# EAGLE design board (EAGLE 6.4)
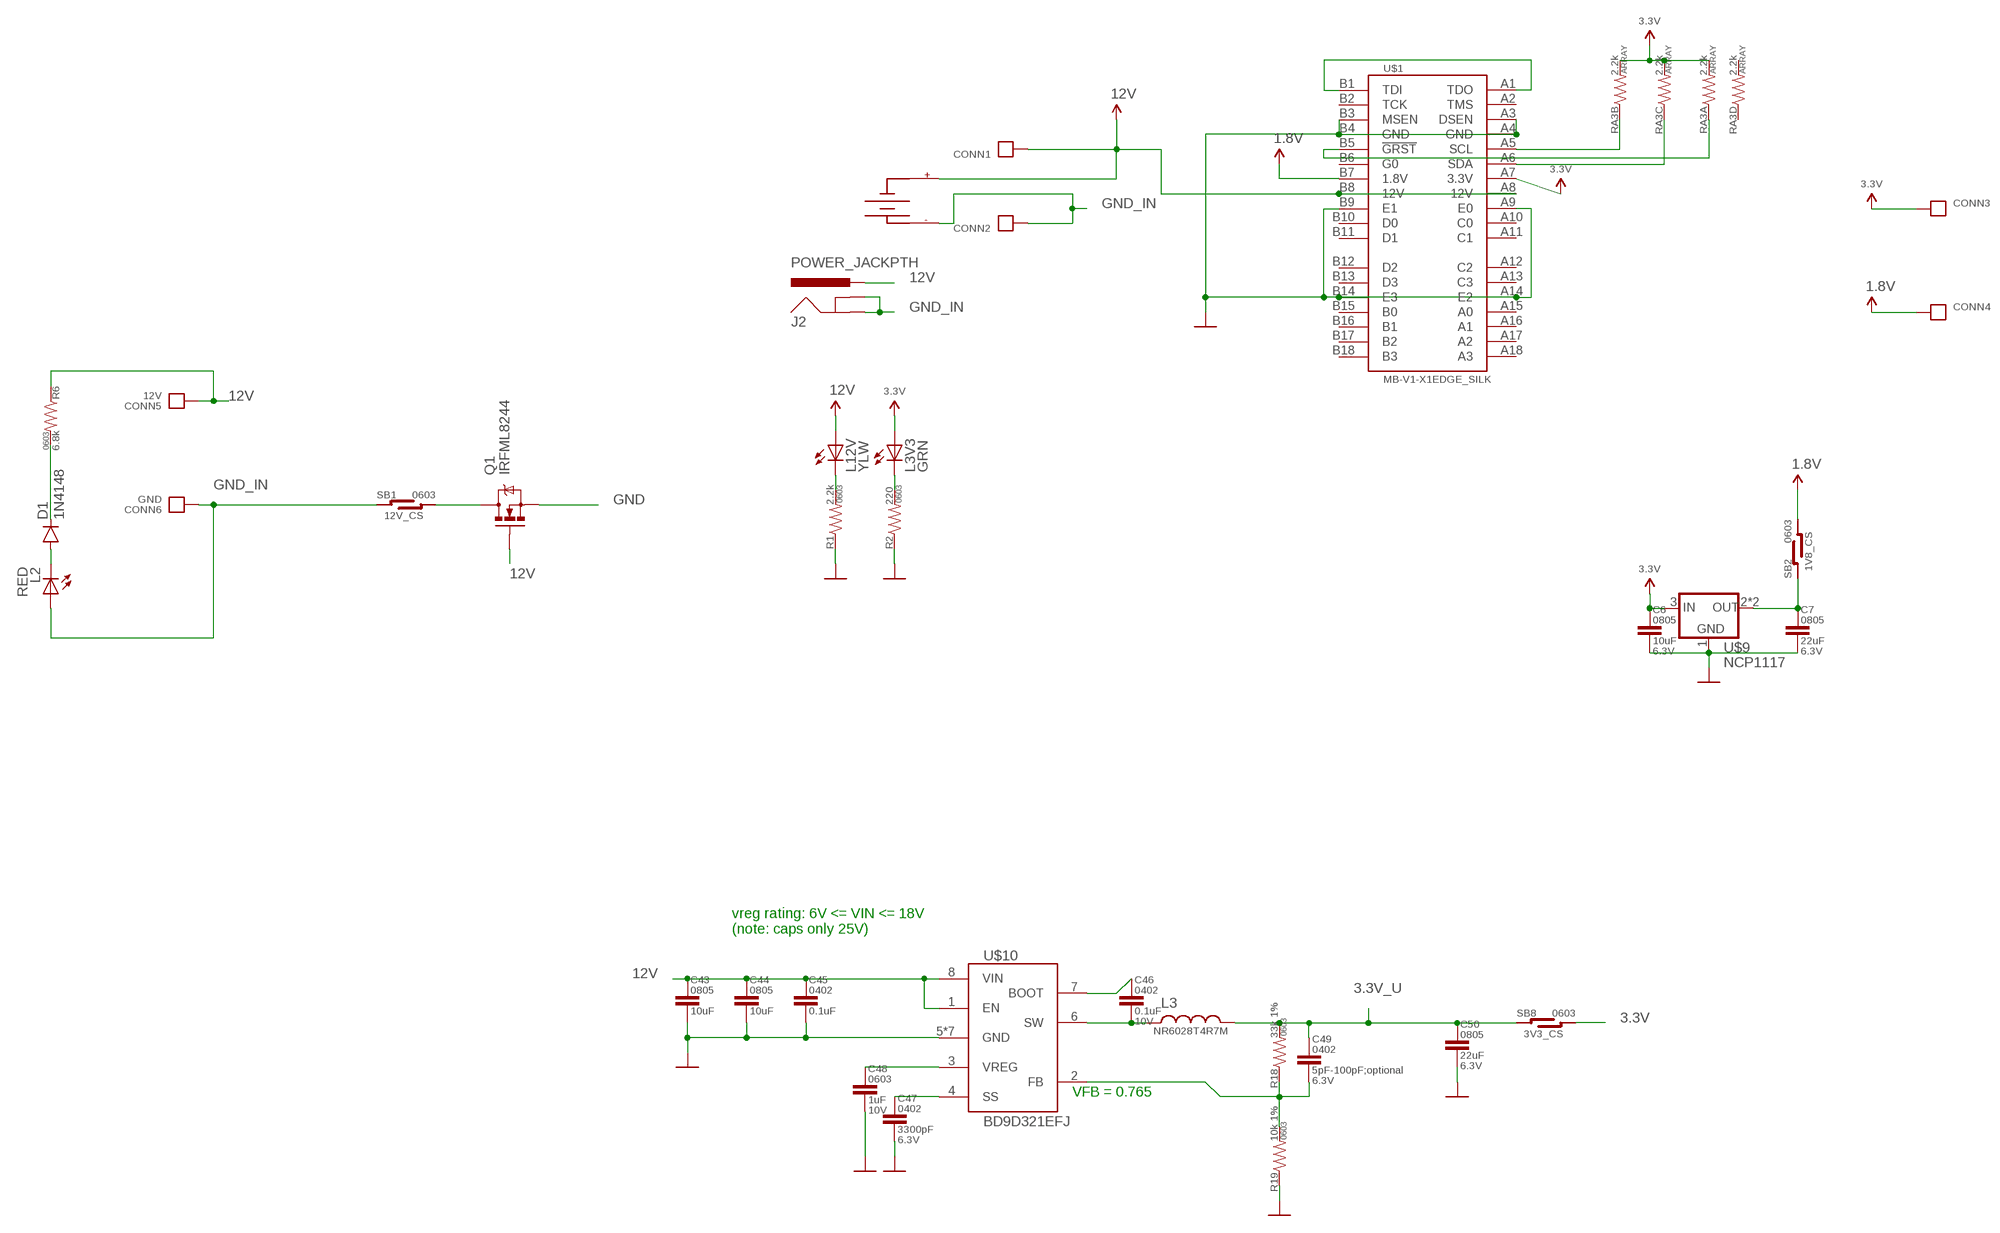
[diagram p0: schematic, sheet 1]

## Parts
C6  10uF  CAP0805  [0805-CAP]
C7  22uF  CAP0805  [0805-CAP]
C43  10uF  CAP0805  [0805-CAP]
C44  10uF  CAP0805  [0805-CAP]
C45  0.1uF  CAP0402-CAP  [0402-CAP]
C46  0.1uF  CAP0402-CAP  [0402-CAP]
C47  3300pF  CAP0402-CAP  [0402-CAP]
C48  1uF  CAP0603  [0603-CAP]
C49  5pF-100pF;optional  CAP0402-CAP  [0402-CAP]
C50  22uF  CAP0805  [0805-CAP]
CONN1  CONNECTOR18AWG  [HOLE_18AWG]
CONN2  CONNECTOR18AWG  [HOLE_18AWG]
CONN3  CONNECTOR18AWG  [HOLE_18AWG]
CONN4  CONNECTOR18AWG  [HOLE_18AWG]
CONN5  12V  CONNECTORSCREW_2.5MM  [SCREW_2.5MM]
CONN6  GND  CONNECTORSCREW_2.5MM  [SCREW_2.5MM]
D1  1N4148  DIODESOD  [SOD-323]
J2  POWER_JACKPTH  [POWER_JACK_PTH]
L2  RED  LED0603  [0603_LED]
L3  NR6028T4R7M  INDUCTORNR60XX  [NR60XX]
L3V3  GRN  LED0603  [0603_LED]
L12V  YLW  LED0603  [0603_LED]
Q1  IRFML8244  MOSFET-NCHANNELBSS138  [SOT23]
R1  2.2k  RESISTOR0603  [0603-RES]
R2  220  RESISTOR0603  [0603-RES]
R6  6.8k  RESISTOR0603  [0603-RES]
R18  33k 1%  RESISTOR0603  [0603-RES]
R19  10k 1%  RESISTOR0603  [0603-RES]
RA3  2.2k  RESISTOR_ARRAY0603_X4  [0603-ARV]
SB1  12V_CS  SOLDER-BRIDGE0603  [SB-0603]
SB2  1V8_CS  SOLDER-BRIDGE0603  [SB-0603]
SB8  3V3_CS  SOLDER-BRIDGE0603  [SB-0603]
U$1  MB-V1-X1EDGE_SILK  [MB-V1-X1-EDGE]
U$4  SUPPLYPCIE-6-RA  [MOLEX_MINIFITJR_6_RA]
U$9  NCP1117  VREGSOT223  [SOT223]
U$10  BD9D321EFJ  [HTSOP8]

## Nets
1.8V: CONN4.P$1(P) SB2.R1 SB2.R2 U$1.B7(1.8V)
3.3V: C6.1 CONN3.P$1(P) L3V3.A RA3.6 RA3.7 RA3.8 SB8.R1 SB8.R2 U$1.A7(3.3V) U$9.3(IN)
3.3V_FB: C49.2 R18.1 R19.2 U$10.2(FB)
3.3V_U: C49.1 C50.1 L3.P$2 R18.2 SB8.L1 SB8.L2
12V: C43.1 C44.1 C45.1 CONN1.P$1(P) CONN5.P J2.PWR L12V.A Q1.1(G) R6.1 U$1.A8(12V) U$1.B8(12V) U$4.1(VSUPPLY) U$4.3(VSUPPLY) U$10.1(EN) U$10.8(VIN)
GND: C6.2 C7.2 C43.2 C44.2 C45.2 C47.2 C48.2 C50.2 Q1.2(S) R1.1 R2.1 R19.1 U$1.A3(DSEN) U$1.A4(GND) U$1.A9(E0) U$1.A14(E2) U$1.B3(MSEN) U$1.B4(GND) U$1.B9(E1) U$1.B14(E3) U$9.1(GND) U$10.5(GND) U$10.P$1(GND) U$10.P$2(GND) U$10.P$3(GND) U$10.P$4(GND) U$10.P$5(GND) U$10.PAD(GND)
GND_IN: CONN2.P$1(P) CONN6.P J2.GND J2.GNDBREAK L2.A SB1.L1 SB1.L2 U$4.4(GND) U$4.6(GND)
N$1: L12V.C R1.2
N$2: C7.1 SB2.L1 SB2.L2 U$9.2(OUT) U$9.4(OUT)
N$6: L3V3.C R2.2
N$8: RA3.3 U$1.A6(SDA)
N$10: Q1.3(D) SB1.R1 SB1.R2
N$11: D1.C R6.2
N$12: RA3.2 U$1.A5(SCL)
N$13: RA3.1 U$1.B5(!GRST)
N$14: D1.A L2.C
N$70: C46.2 L3.P$1 U$10.6(SW)
N$71: C46.1 U$10.7(BOOT)
N$72: C48.1 U$10.3(VREG)
N$76: C47.1 U$10.4(SS)
TDI: U$1.A1(TDO) U$1.B1(TDI)
Unconnected: RA3.4 RA3.5 U$1.A2(TMS) U$1.A10(C0) U$1.A11(C1) U$1.A12(C2) U$1.A13(C3) U$1.A15(A0) U$1.A16(A1) U$1.A17(A2) U$1.A18(A3) U$1.B2(TCK) U$1.B6(G0) U$1.B10(D0) U$1.B11(D1) U$1.B12(D2) U$1.B13(D3) U$1.B15(B0) U$1.B16(B1) U$1.B17(B2) U$1.B18(B3)

## Notes on the sheet
- vreg rating: 6V <= VIN <= 18V
  (note: caps only 25V)
- VFB = 0.765

## Library data of the parts
C6 C7 C50 = kmod-passives:CAP: Capacitor Standard 0603 ceramic capacitor, and 0.1" leaded capacitor.; PACKAGE: 0805; VOLTAGE: 6.3V
C43 C44 = kmod-passives:CAP: Capacitor Standard 0603 ceramic capacitor, and 0.1" leaded capacitor.; PACKAGE: 0805; VOLTAGE: 25V
C45 = kmod-passives:CAP: Capacitor Standard 0603 ceramic capacitor, and 0.1" leaded capacitor.; PACKAGE: 0402; VOLTAGE: 25V
C46 = kmod-passives:CAP: Capacitor Standard 0603 ceramic capacitor, and 0.1" leaded capacitor.; PACKAGE: 0402; VOLTAGE: 10V
C47 C49 = kmod-passives:CAP: Capacitor Standard 0603 ceramic capacitor, and 0.1" leaded capacitor.; PACKAGE: 0402; VOLTAGE: 6.3V
C48 = kmod-passives:CAP: Capacitor Standard 0603 ceramic capacitor, and 0.1" leaded capacitor.; PACKAGE: 0603; VOLTAGE: 10V
CONN1-CONN6 = kmod-nonparts:CONNECTOR: Collection of holes/pads for testing/connecting
D1 = SparkFun-DiscreteSemi:DIODE: Diode These are standard reverse protection diodes and small signal diodes. SMA package can handle up to about 1A. SOD-323 can handle about 200mA. What the SOD-323 package when ordering, there are some mfgs out there that are 5-pin packages.; PROD_ID: DIO-09646
J2 = SparkFun-Connectors:POWER_JACK: Power Jack This is the standard 5.5mm barrel jack for power. The PTH is the most common, proven, reliable, footprint. The Slot footprint only works if the mill layer is transmitted to the PCB fab house so be warned. Mating wall wart : TOL-00298 (and others); PROD_ID: PRT-00119
L2 L3V3 L12V = kmod-passives:LED
L3 = kmod-passives:INDUCTOR
Q1 = SparkFun-DiscreteSemi:MOSFET-NCHANNEL: Common NMOSFET Parts MFG P/N Store ID Prod ID FDD8780 TRANS-09984 SI7820DN TRANS-11055 FDS6630A IC-08089 2N7002PW TRANS-11151 FQP30N06L COM-10213 TRANS-10060 BSS123LT1G TRANS-08345 BSS138 TRANS-00830 BS170 2N7000; PROD_ID: TRANS-00830
R1 R2 R6 R18 R19 = kmod-passives:RESISTOR: Resistor Basic schematic elements and footprints for 0603, 1206, and PTH resistors.; PACKAGE: 0603
RA3 = kmod-passives:RESISTOR_ARRAY; PACKAGE: ARRAY
SB1 SB2 SB8 = kmod-nonparts:SOLDER-BRIDGE; PACKAGE: 0603
U$1 = kmod-connectors:MB-V1-X1
U$4 = kmod-connectors:SUPPLY
U$9 = kmod-ics:VREG
U$10 = kmod-testing:BD9D321

## Board
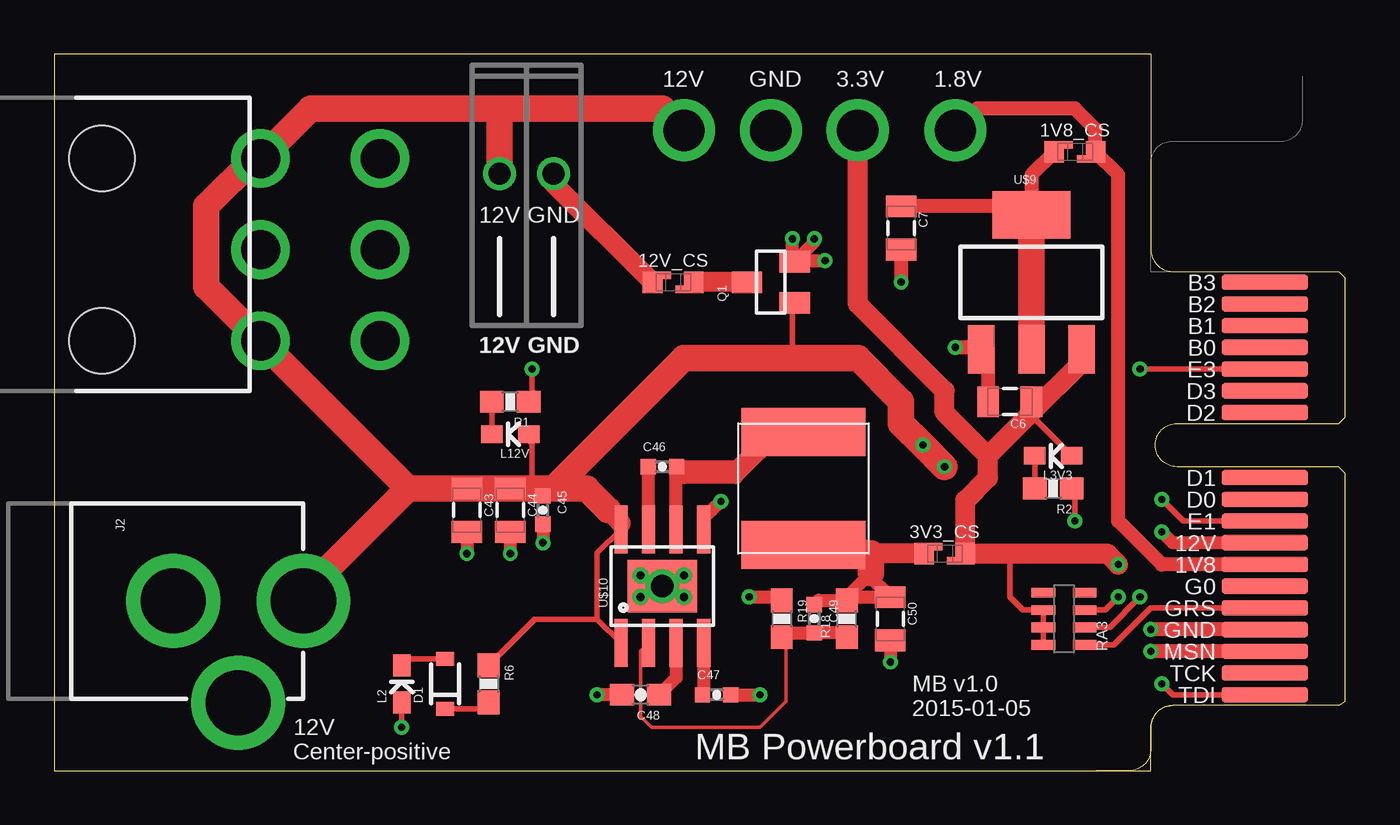
[diagram p1: board, top side]
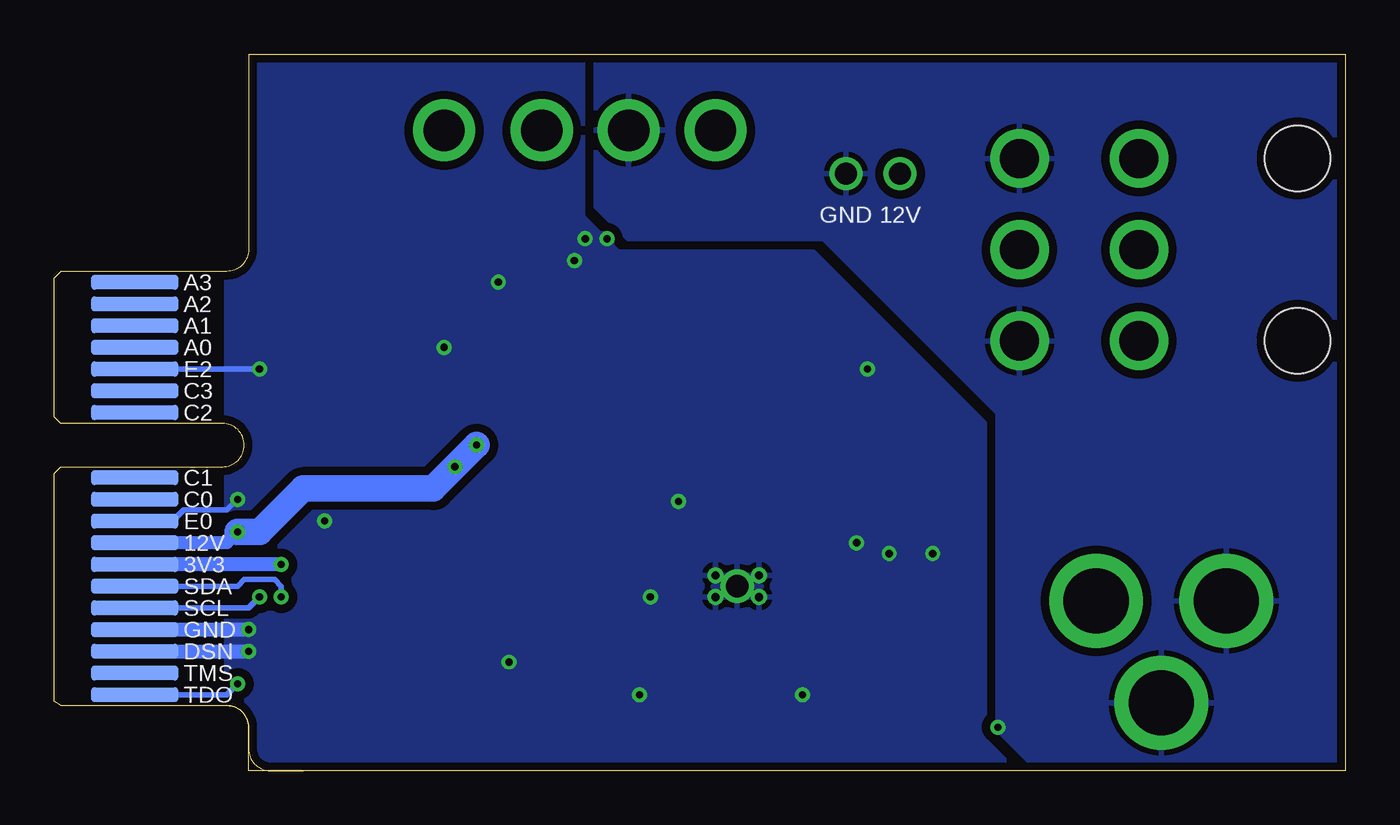
[diagram p2: board, bottom side, seen from below]

Size 59.45 x 33 mm. Coordinates in mm from the lower left corner, seen from the top.
Outline: 51.5,3 arc90 50.5,2 50.5,0 0,0 0,33 50.5,33 50.5,24 arc90 51.5,23
Copper layers (1*16): Top 0.0356mm / dielectric 1.5011mm / Bottom 0.0356mm
Design rules "OSHPark_mine": minimum track width 6mil, minimum drill 13mil, track to track 6mil, track to pad 6mil, pad to pad 6mil, via to via 6mil, smd to smd 6mil, copper to edge 15mil, drill to drill 6mil, minimum pad ring 7mil, minimum via ring 7mil, stop-mask expansion 2mil, vias tented up to drill 13mil, thermal gap 10mil

### Footprints (pad centres in the part's own frame; a part is rotated, then mirrored left to right if it is on the bottom)
0805-CAP = smd 1 x 1.4: 1 -1,0; 2 1,0
0402-CAP = smd 0.7 x 0.7: 1 -0.65,0; 2 0.65,0
0603-CAP = smd 1.1 x 1: 1 -0.85,0; 2 0.85,0
HOLE_18AWG = drill 1.905: P$1 0,0
SCREW_2.5MM = drill 1.016: P 0,0
SOD-323 = smd 0.63 x 0.83: A 1.15,0; C -1.15,0
POWER_JACK_PTH = drill 2.997 pad 4.318: GND 0,7.7; GNDBREAK 4.7,10.7; PWR 0,13.7
0603_LED = smd 0.8 x 1.003: A 0,-0.852; C 0,0.852
NR60XX = smd 2.2 x 5.7: P$1 2.6,0; P$2 -2.6,0
SOT23 = smd 1 x 1.4: 1 -0.95,-1.1; 2 0.95,-1.1; 3 0,1.1
0603-RES = smd 1.1 x 1: 1 -0.85,0; 2 0.85,0
0603-ARV = smd 0.45 x 1.1: 1 -1.2,-0.95; 2 -0.4,-0.95; 3 0.4,-0.95; 4 1.2,-0.95; 5 1.2,0.95; 6 0.4,0.95; 7 -0.4,0.95; 8 -1.2,0.95
SB-0603 = smd 0.9 x 1: L1 -0.95,0; R1 0.95,0 | smd 0.4 x 0.35: L2 -0.3,0.325; R2 0.3,-0.325
MB-V1-X1-EDGE = smd 0.7 x 4 bottom: A1 -11.5,-0.75; A2 -10.5,-0.75; A3 -9.5,-0.75; A4 -8.5,-0.75; A5 -7.5,-0.75; A6 -6.5,-0.75; A7 -5.5,-0.75; A8 -4.5,-0.75; A9 -3.5,-0.75; A10 -2.5,-0.75; A11 -1.5,-0.75; A12 1.5,-0.75; A13 2.5,-0.75; A14 3.5,-0.75; A15 4.5,-0.75; A16 5.5,-0.75; A17 6.5,-0.75; A18 7.5,-0.75 | smd 0.7 x 4: B1 -11.5,-0.75; B2 -10.5,-0.75; B3 -9.5,-0.75; B4 -8.5,-0.75; B5 -7.5,-0.75; B6 -6.5,-0.75; B7 -5.5,-0.75; B8 -4.5,-0.75; B9 -3.5,-0.75; B10 -2.5,-0.75; B11 -1.5,-0.75; B12 1.5,-0.75; B13 2.5,-0.75; B14 3.5,-0.75; B15 4.5,-0.75; B16 5.5,-0.75; B17 6.5,-0.75; B18 7.5,-0.75
MOLEX_MINIFITJR_6_RA = drill 1.8: 1 4.2,0; 2 0,0; 3 -4.2,0; 4 4.2,5.5; 5 0,5.5; 6 -4.2,5.5 | hole 3: -4.2,-7.3; 4.2,-7.3
SOT223 = smd 1.219 x 2.235: 1 -2.311,-3.099; 2 0,-3.099; 3 2.311,-3.099 | smd 3.6 x 2.2: 4 0,3.099
HTSOP8 = smd 0.61 x 2.21: 1 -1.905,-2.616; 2 -0.635,-2.616; 3 0.635,-2.616; 4 1.905,-2.616; 5 1.905,2.616; 6 0.635,2.616; 7 -0.635,2.616; 8 -1.905,2.616 | drill 1.016: P$1 0,0 | drill 0.381: P$2 -1,0.5; P$3 -1,-0.5; P$4 1,-0.5; P$5 1,0.5 | smd 3.2 x 2.4: PAD 0,0

### Placement (x,y rotation side)
C6  44,17 180 top
C7  39,25 270 top
C43  19,12 270 top
C44  21,12 270 top
C45  22.5,12 270 top
C46  28,14 0 top
C47  30.5,3.5 0 top
C48  27,3.5 180 top
C49  35,7 270 top
C50  38.5,7 270 top
CONN1  29,29.5 90 top
CONN2  33,29.5 90 top
CONN3  37,29.5 0 top
CONN4  41.5,29.5 0 top
CONN5  20.5,27.5 180 top
CONN6  23,27.5 180 top
D1  18,4 90 top
J2  -2.23,7.82 270 top
L2  16,4 0 top
L3  34.5,13 90 top
L3V3  46,14.5 90 top
L12V  21,15.5 90 top
Q1  33,22.5 90 top
R1  21,17 180 top
R2  46,13 180 top
R6  20,4 270 top
R18  36.5,7 90 top
R19  33.5,7 270 top
RA3  46.5,7 90 top
SB1  28.5,22.5 0 top
SB2  47,28.5 0 top
SB8  41,10 0 top
U$1  55,15 90 top
U$4  9.5,24 270 top
U$9  45,22.5 0 top
U$10  28,8.5 0 top

### Tracks (layer width: path | path; a pad name or v marks a point on that pad's centre or on a via)
1.8V
  Top 0.152: SB2.R2 47.62,28.18 SB2.R1
  Top 0.635: U$1.B7 51,9.5 49,11.5 49,27.45 SB2.R1 47.95,29.55 47,30.5 42.5,30.5 CONN4.P$1
3.3V  (via drill 0.33)
  Top 0.152: SB8.R1 41.62,9.68 SB8.R2
  Top 0.254: RA3.8 RA3.7 RA3.6 44.6,7.4 44,8 44,10 | L3V3.A 45,16.35 45,16.5 C6.1
  Top 0.914: 43,14.5 43,13.5 41.95,12.45 SB8.R1 44,10 48.5,10 v49,9.5 | CONN3.P$1 37,21.5 41,17.5 41,16.5 43,14.5 | 43,14.5 45,16.5 47.31,18.81 U$9.3
  Bottom 0.635: v49,9.5 U$1.A7
3.3V_FB
  Top 0.152: U$10.2 27,5.52 27,2.5 27.5,2 32.5,2 33.7,3.2 33.7,6.35
  Top 0.61: R18.1 36.3,6.35 C49.2 33.7,6.35 R19.2
3.3V_U
  Top 0.152: SB8.L1 40.38,10.32 SB8.L2
  Top 0.61: C49.1 35.2,7.85 R18.2 36.65,8 C50.1 37.5,9 | 37.5,9 36.5,8 | 37.5,9 37.6,9.1
  Top 0.914: SB8.L1 37.6,10
  Top 1.219: L3.P$2 37.6,10 37.6,9.1
12V  (via drill 0.33)
  Top 0.254: C45.1 22.5,13 | L12V.A 21.71,15.36 22,15.07 22,13 | Q1.1 34,21.45 34,19 | U$10.8 25,10.02 25,6.98 | 25,6.98 U$10.1 | 25,6.98 22.13,6.98 R6.1
  Top 0.61: 26.09,11.4 U$10.8 | U$1.A8 51.5,10.5 v51,11
  Top 0.914: 25.5,12 26.09,11.4
  Top 1.219: 20.5,30.5 11.8,30.5 U$4.3 9.2,28.2 7,26 7,22.3 U$4.1 16.3,13 | 20.5,30.5 28,30.5 CONN1.P$1 | 16.3,13 C43.1 C44.1 22,13 22.5,13 23,13 | 23,13 24.5,13 25.5,12 | CONN5.P 20.5,30.5 | 23,13 29,19 34,19 37,19 39,17 39,16 v40,15 v41,14 | 16.3,13 11.47,8.17 J2.PWR
  Bottom 0.61: v51,11 51.5,10.5 U$1.A8
  Bottom 1.219: v40,15 42,13 48,13 50,11 v51,11
GND  (via drill 0.33)
  Top 0.254: R1.1 22,17.15 v22,18.5 | U$1.B14 v50,18.5 | U$1.B9 52,11.5 v51,12.5 | R2.1 47,12.85 v47,11.5
  Top 0.61: C48.2 v25,3.5 | C44.2 v21,10 | C43.2 v19,10 | C45.2 v22.5,10.5 | C47.2 v32.5,3.5 | v30.7,12.4 30.29,12 29.91,11.62 U$10.5 | C50.2 v38.5,5 | Q1.2 34,23.55 v34,24.5 | Q1.2 35,24.35 v35,24.5 | Q1.2 34.15,23.5 v35.5,23.5 | v32,8 33.35,8 R19.1
  Top 0.635: v41.5,19.5 42.59,19.5 U$9.1 43,19.4 C6.2 | C7.2 v39,22.5 | U$1.B3 v50.5,5.5 | U$1.A4 v50.5,6.5
  Bottom 0.254: U$1.B14 v50,18.5 | U$1.B9 54,11.5 53.5,12 51.5,12 v51,12.5
  Bottom 0.635: U$1.B3 v50.5,5.5 | U$1.A4 v50.5,6.5
  pour Bottom (isolate 0.381, rank 2): -2,35 51.5,35 51.5,-2 -2,-2
GND_IN  (via drill 0.33)
  Top 0.152: SB1.L1 27.88,22.82 SB1.L2
  Top 0.254: L2.A v16,2
  Top 0.914: SB1.L1 23,27.05 CONN6.P
  pour Bottom (isolate 0.381): -1,34 34.5,34 34.5,26 33,24.5 24,24.5 16,16.5 16,1.92 13.08,-1 -1,-1
N$1
  Top 0.254: L12V.C R1.2
N$2
  Top 0.152: SB2.L2 46.38,28.82 SB2.L1
  Top 0.635: SB2.L1 45,27.45 U$9.4 | 45,25.5 U$9.4 | U$9.4 44.6,26 C7.1
  Top 1.219: U$9.2 U$9.4
N$6
  Top 0.254: R2.2 L3V3.C
N$8  (via drill 0.33)
  Top 0.254: RA3.3 48.4,7.4 v49,8
  Bottom 0.254: v49,8 49,8.5 49.3,8.8 50.7,8.8 51,8.5 U$1.A6
N$10
  Top 0.152: SB1.R1 29.12,22.18 SB1.R2
  Top 0.914: Q1.3 SB1.R1
N$11
  Top 0.254: D1.C 19.7,2.85 R6.2
N$12  (via drill 0.33)
  Top 0.254: RA3.2 48.6,6.6 v50,8
  Bottom 0.254: U$1.A5 50.5,7.5 v50,8
N$13
  Top 0.254: RA3.1 48.8,5.8 50.5,7.5 U$1.B5
N$14
  Top 0.254: L2.C 16.3,5.15 D1.A
N$70
  Top 0.61: U$10.6 28.64,13.98 C46.2 31.4,14 33,15.6 L3.P$1 33.5,15.6 31.4,13.5 29,13.5
N$71
  Top 0.61: U$10.7 27.36,13.98 C46.1
N$72
  Top 0.61: U$10.3 28.64,4.29 C48.1
N$76
  Top 0.61: U$10.4 29.91,3.56 C47.1
TDI  (via drill 0.33)
  Top 0.254: U$1.B1 51.5,3.5 v51,4
  Bottom 0.254: v51,4 51.5,3.5 U$1.B1

### Text on the board
tPlace: 12V | GND | 3.3V | 1.8V | MB v1.0 / 2015-01-05 | 12V / Center-positive | MB Powerboard v1.1